# EasyEDA schematic Cannabis Humidity_2021-02-28.json
TITLE: CannArduino; REV: 1.0; Date: 2021-02-23; Sheet: 1/1; Drawn By: xFBi; Company: U Want My Info
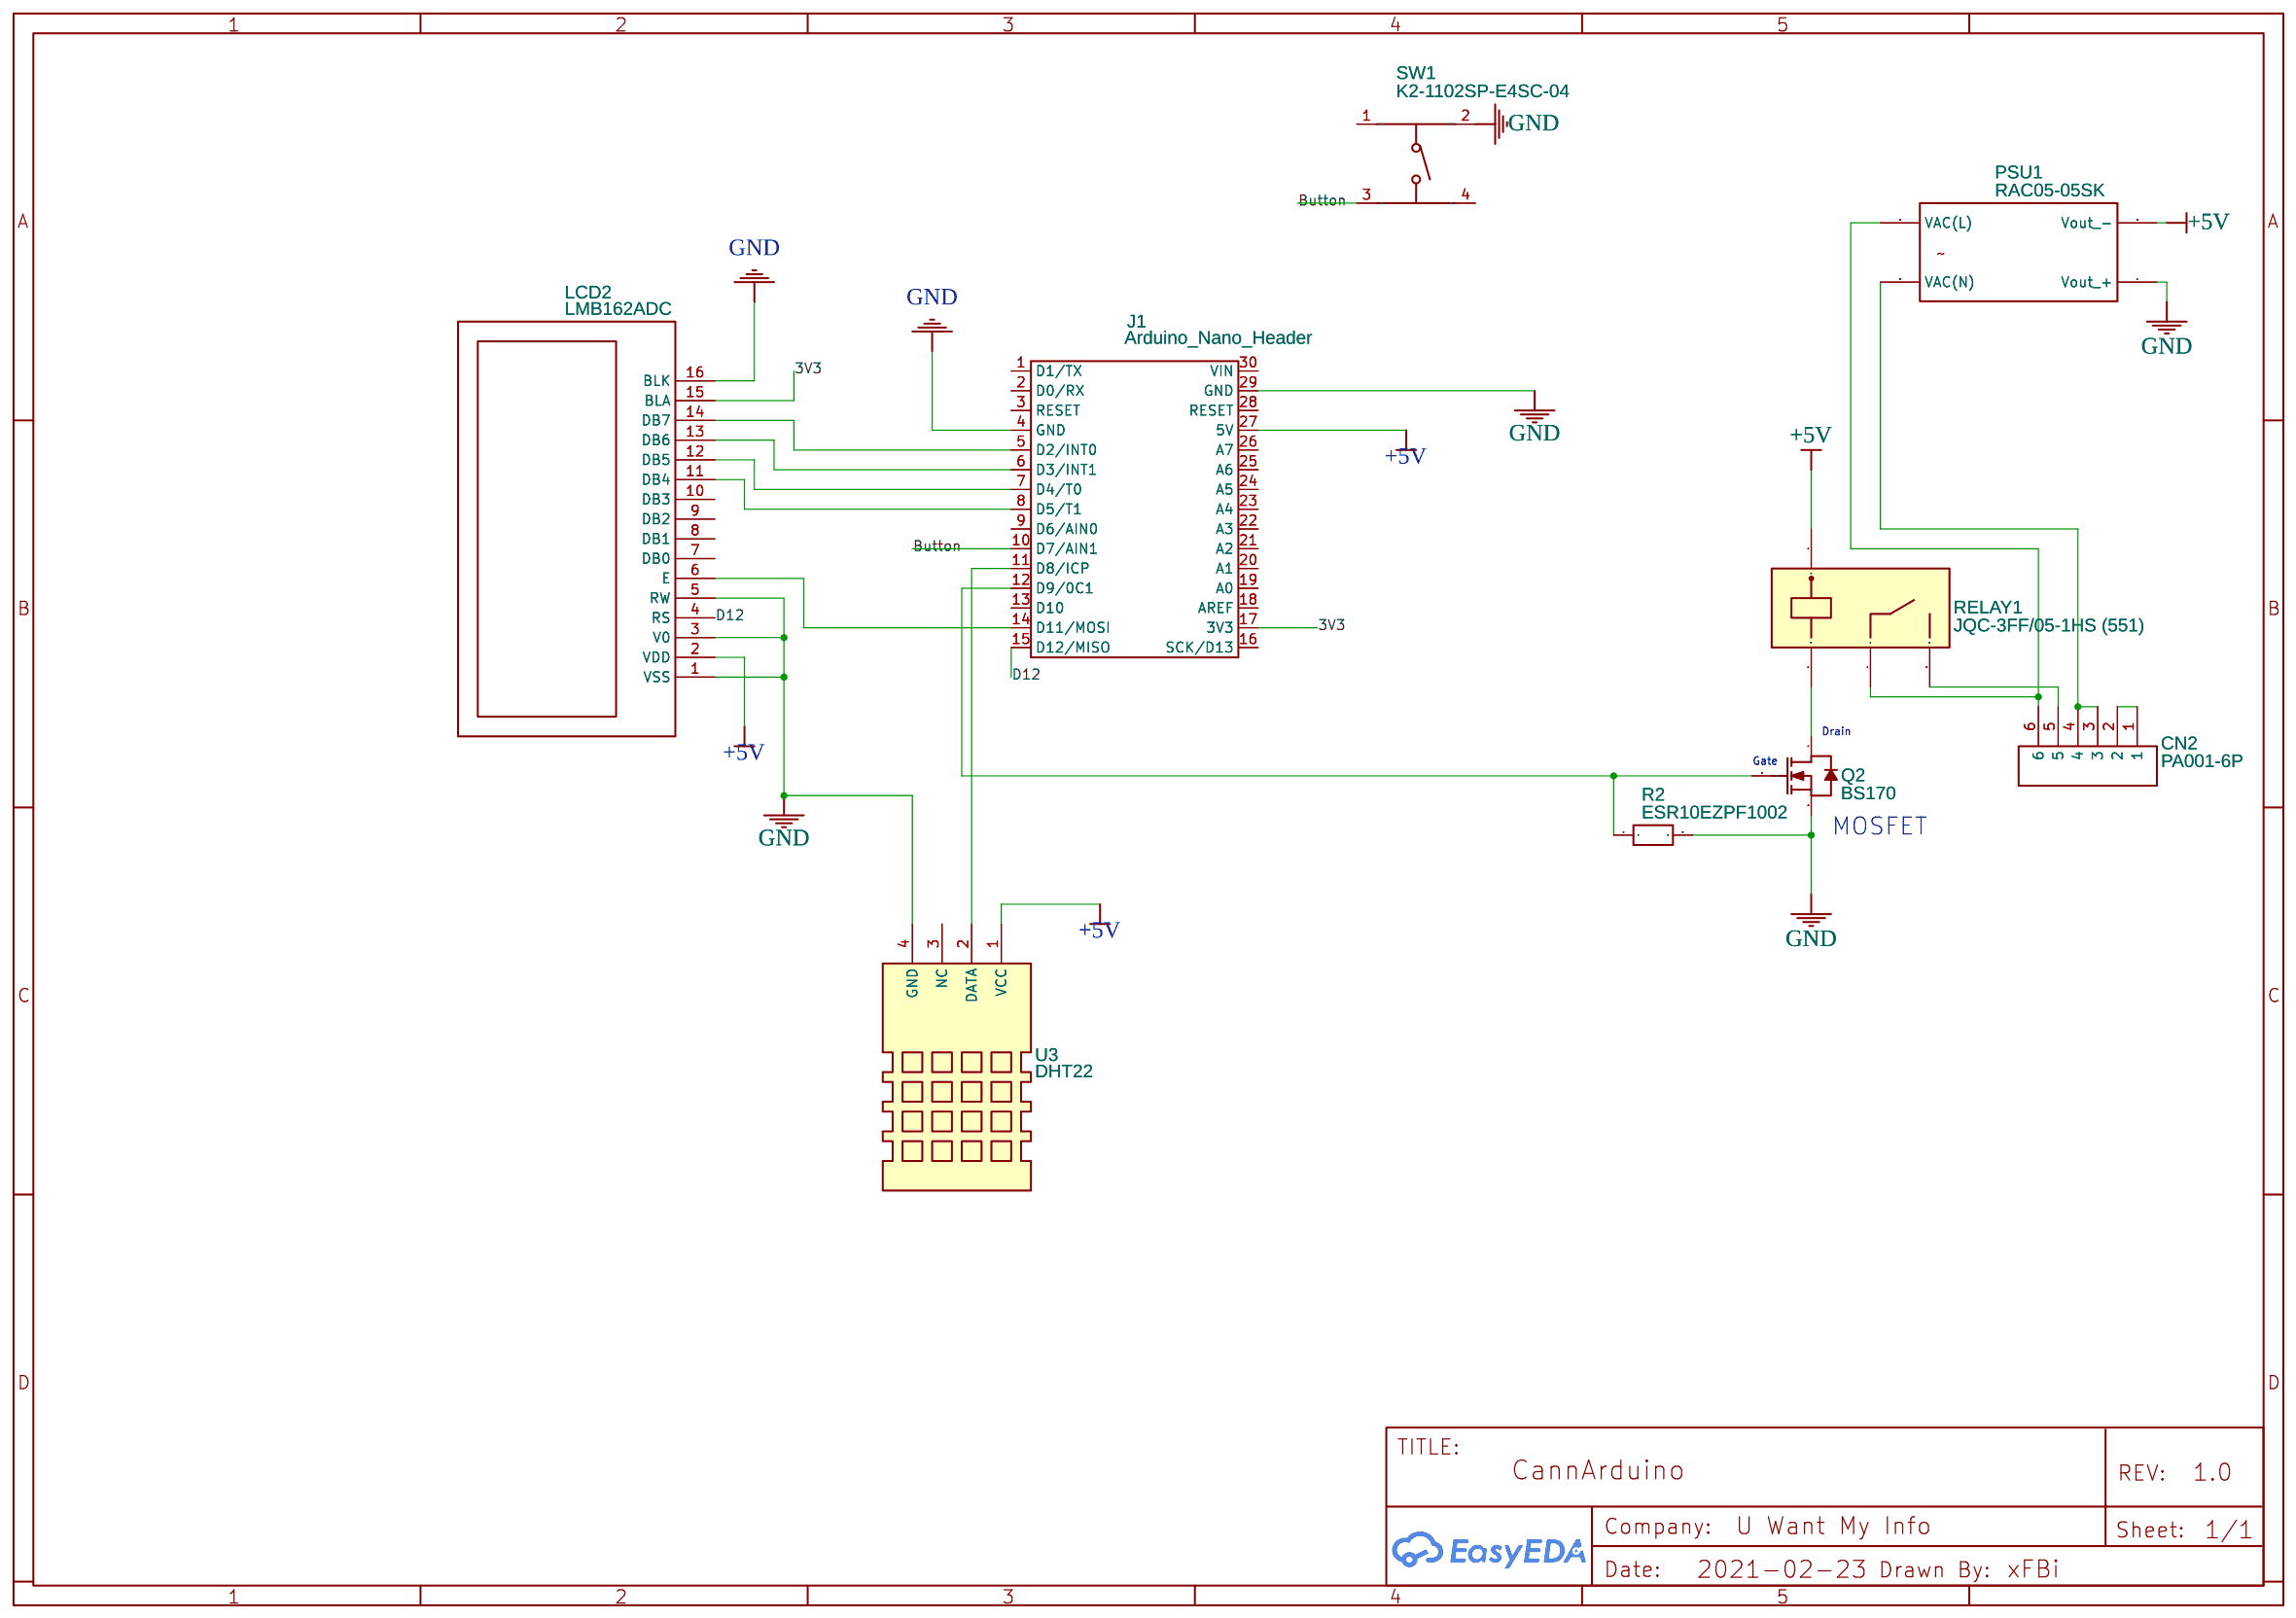
[diagram p0: schematic sheet]

## Parts
CN2  PA001-6P  [CONN-TH_6P-P5.00_PA001-6P]
J1  Arduino_Nano_Header  [DIP-30_L43.18-W15.24-ARDUINONANO]
LCD2  LMB162ADC  [LMB162ADC-80X36MM]
PSU1  RAC05-05SK  [RAC05-05SK]
Q2  BS170  [TO-92-3_L4.9-W3.7-P1.27-L]
R2  ESR10EZPF1002  [R0805]
RELAY1  JQC-3FF/05-1HS (551)  [RELAY-TH_JQC-3FF-05-1HS-551]
SW1  K2-1102SP-E4SC-04  [KEY-SMD_4P-L6.0-W6.0-P4.50-LS9.0]
U3  DHT22  [DHT22_AM2303_VERT]

## Library data of the parts
CN2 = PA001-6P: Supplier: LCSC; Supplier Part: C173288; Manufacturer: HIWA; Contributor: LCSC; LCSC Assembly: Yes; SMT Type: Extend; Assembly Type: manualWeld; Paste Type: expand
J1 = Arduino_Nano_Header
LCD2 = LMB162ADC: Supplier: LCSC; Manufacturer: TOPWAY; Supplier Part: C9741
PSU1 = RAC05-05SK: Contributor: User777; Supplier Part: 919-RAC05-05SK; Supplier: Mouser; link: https://mouser.com/ProductDetail/RECOM-Power/RAC05-05SK; Manufacturer: RECOM Power
Q2 = BS170: Supplier: LCSC; Manufacturer: FAIRCHILD; Supplier Part: C111691; LCSC Assembly: Yes; SMT Type: Extend; Assembly Type: manualWeld; Paste Type: expand
R2 = ESR10EZPF1002: Supplier: LCSC; Supplier Part: C510098; Manufacturer: ROHM Semicon; Contributor: LCSC
RELAY1 = JQC-3FF/05-1HS (551): Supplier: LCSC; Manufacturer: HF; image: //image.lceda.cn/szlcsc/C9224.jpg; Supplier Part: C9224; LCSC Assembly: Yes; SMT Type: Extend; Assembly Type: manualWeld; Paste Type: expand
SW1 = K2-1102SP-E4SC-04: Supplier: LCSC; Manufacturer: HRO; Contributor: LCSC; Supplier Part: C136669; LCSC Assembly: Yes; SMT Type: Extend; Assembly Type: smtWeld; Paste Type: expand
U3 = DHT22: Digital-output relative humidity & temperature sensor/module; sourceId: GkiDrp9vf; Supplier Part: PRODUCT ID: 385; Supplier: AdaFruit; Voltage: 3.3V - 5.5V; Mounted: Yes; Manufacturer: Aosong (Guangzhou) Electronics Co., Ltd.; link: https://cdn-shop.adafruit.com/datasheets/DHT22.pdf

## Nets
3V3: J1.17(3V3) LCD2.15(BLA)
+5V: J1.27(5V) LCD2.2(VDD) PSU1.5(Vout -) RELAY1.1 U3.1(VCC)
GND: J1.4(GND) J1.29(GND) LCD2.1(VSS) LCD2.3(V0) LCD2.5(RW) LCD2.16(BLK) PSU1.4(Vout +) Q2.3(S) R2.2 SW1.2 U3.4(GND)
Button: J1.10(D7/AIN1) SW1.3
D12: J1.15(D12/MISO) LCD2.4(RS)
Net-(CN2-1): CN2.1 CN2.2
Net-(CN2-3): CN2.3 CN2.4 PSU1.2(VAC(N))
Net-(CN2-5): CN2.5 RELAY1.3
Net-(CN2-6): CN2.6 PSU1.1(VAC(L)) RELAY1.4
Net-(J1-5): J1.5(D2/INT0) LCD2.14(DB7)
Net-(J1-6): J1.6(D3/INT1) LCD2.13(DB6)
Net-(J1-7): J1.7(D4/T0) LCD2.12(DB5)
Net-(J1-8): J1.8(D5/T1) LCD2.11(DB4)
Net-(J1-11): J1.11(D8/ICP) U3.2(DATA)
Net-(J1-12): J1.12(D9/0C1) Q2.2(G) R2.1
Net-(J1-14): J1.14(D11/MOSI) LCD2.6(E)
Net-(Q2-1): Q2.1(D) RELAY1.2

Not connected (* = marked no-connect by the designer): J1 1(D1/TX) 2(D0/RX) 3(RESET) 9(D6/AIN0) 13(D10) 16(SCK/D13) 18(AREF) 19(A0) 20(A1) 21(A2) 22(A3) 23(A4) 24(A5) 25(A6) 26(A7) 28(RESET) 30(VIN); LCD2 7(DB0) 8(DB1) 9(DB2) 10(DB3); SW1 1 4; U3 3(NC)

## Notes on the sheet
- Drain
- Gate
- MOSFET
